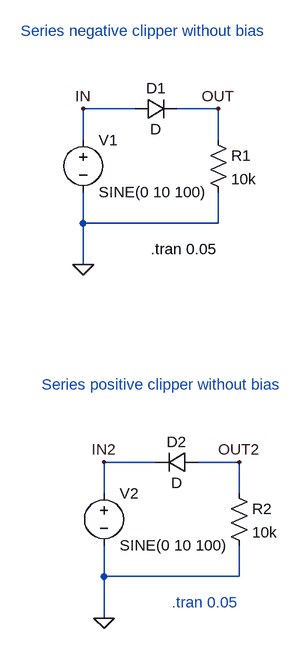
[diagram p0: schematic Series_Positive_clipper_with_bias.asc]
Series_Positive_clipper_with_bias.asc, the LTspice schematic file:
Version 4.1
SHEET 1 880 868
WIRE 176 64 96 64
WIRE 304 64 240 64
WIRE 96 112 96 64
WIRE 304 112 304 64
WIRE 96 240 96 192
WIRE 304 240 304 192
WIRE 304 240 96 240
WIRE 96 304 96 240
WIRE 208 608 128 608
WIRE 336 608 272 608
WIRE 128 656 128 608
WIRE 336 656 336 608
WIRE 128 784 128 736
WIRE 336 784 336 736
WIRE 336 784 128 784
WIRE 128 848 128 784
FLAG 96 64 IN
FLAG 304 64 OUT
FLAG 96 304 0
FLAG 128 608 IN2
FLAG 336 608 OUT2
FLAG 128 848 0
SYMBOL voltage 96 96 R0
WINDOW 123 0 0 Left 0
WINDOW 39 0 0 Left 0
SYMATTR InstName V1
SYMATTR Value SINE(0 10 100)
SYMBOL diode 176 80 R270
WINDOW 0 32 32 VTop 2
WINDOW 3 0 32 VBottom 2
SYMATTR InstName D1
SYMBOL res 288 96 R0
SYMATTR InstName R1
SYMATTR Value 10k
SYMBOL voltage 128 640 R0
WINDOW 123 0 0 Left 0
WINDOW 39 0 0 Left 0
SYMATTR InstName V2
SYMATTR Value SINE(0 10 100)
SYMBOL diode 272 592 R90
WINDOW 0 0 32 VBottom 2
WINDOW 3 32 32 VTop 2
SYMATTR InstName D2
SYMBOL res 320 640 R0
SYMATTR InstName R2
SYMATTR Value 10k
TEXT 200 280 Left 2 !.tran 0.05
TEXT 0 -56 Left 2 ;Series negative clipper without bias
TEXT 232 824 Left 2 ;.tran 0.05
TEXT 32 488 Left 2 ;Series positive clipper without bias

The netlist it stands for:
* Series_Positive_clipper_with_bias.asc
V1 IN 0 SINE(0 10 100)
D1 IN OUT D
R1 OUT 0 10k
V2 IN2 0 SINE(0 10 100)
D2 OUT2 IN2 D
R2 OUT2 0 10k
.model D D
.lib standard.dio
.tran 0.05
* Series negative clipper without bias
* .tran 0.05
* Series positive clipper without bias
.backanno
.end